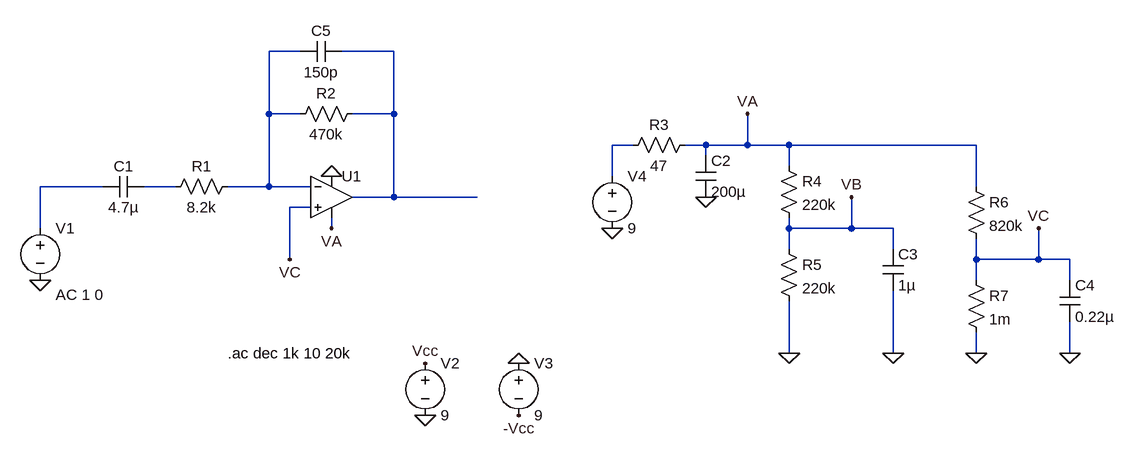
[diagram p0: schematic op_amp3.asc]
op_amp3.asc, the LTspice schematic file:
Version 4
SHEET 1 3044 724
WIRE 448 -256 400 -256
WIRE 592 -256 512 -256
WIRE 400 -160 400 -256
WIRE 448 -160 400 -160
WIRE 592 -160 592 -256
WIRE 592 -160 528 -160
WIRE 960 -112 928 -112
WIRE 1072 -112 1040 -112
WIRE 1136 -112 1136 -160
WIRE 1136 -112 1072 -112
WIRE 1200 -112 1136 -112
WIRE 1488 -112 1200 -112
WIRE 1072 -96 1072 -112
WIRE 1200 -80 1200 -112
WIRE 928 -64 928 -112
WIRE 144 -48 48 -48
WIRE 256 -48 208 -48
WIRE 400 -48 400 -160
WIRE 400 -48 336 -48
WIRE 464 -48 400 -48
WIRE 1488 -48 1488 -112
WIRE 592 -32 592 -160
WIRE 592 -32 528 -32
WIRE 720 -32 592 -32
WIRE 464 -16 432 -16
WIRE 48 16 48 -48
WIRE 496 16 496 0
WIRE 1200 16 1200 0
WIRE 1296 16 1296 -32
WIRE 1296 16 1200 16
WIRE 1360 16 1296 16
WIRE 1200 48 1200 16
WIRE 1360 48 1360 16
WIRE 432 64 432 -16
WIRE 1488 64 1488 32
WIRE 1584 64 1584 16
WIRE 1584 64 1488 64
WIRE 1632 64 1584 64
WIRE 1488 96 1488 64
WIRE 1632 96 1632 64
WIRE 1200 208 1200 128
WIRE 1360 208 1360 112
WIRE 1488 208 1488 176
WIRE 1632 208 1632 160
FLAG 640 304 0
FLAG 784 224 0
FLAG 640 224 Vcc
FLAG 784 304 -Vcc
FLAG 48 96 0
FLAG 928 16 0
FLAG 1072 -32 0
FLAG 1136 -160 VA
FLAG 1296 -32 VB
FLAG 496 16 VA
FLAG 432 64 VC
FLAG 496 -64 0
FLAG 1200 208 0
FLAG 1360 208 0
FLAG 1488 208 0
FLAG 1632 208 0
FLAG 1584 16 VC
SYMBOL voltage 640 208 R0
SYMATTR InstName V2
SYMATTR Value 9
SYMBOL voltage 784 208 R0
SYMATTR InstName V3
SYMATTR Value 9
SYMBOL OpAmps/UniversalOpAmp 496 -32 R0
SYMATTR InstName U1
SYMBOL voltage 48 0 R0
WINDOW 123 24 118 Left 2
SYMATTR Value2 AC 1 0
SYMATTR InstName V1
SYMATTR Value ""
SYMBOL cap 208 -64 R90
WINDOW 0 0 32 VBottom 2
WINDOW 3 32 32 VTop 2
SYMATTR InstName C1
SYMATTR Value 4.7µ
SYMBOL res 352 -64 R90
WINDOW 0 0 56 VBottom 2
WINDOW 3 32 56 VTop 2
SYMATTR InstName R1
SYMATTR Value 8.2k
SYMBOL res 544 -176 R90
WINDOW 0 0 56 VBottom 2
WINDOW 3 32 56 VTop 2
SYMATTR InstName R2
SYMATTR Value 470k
SYMBOL voltage 928 -80 R0
SYMATTR InstName V4
SYMATTR Value 9
SYMBOL res 1056 -128 R90
WINDOW 0 0 56 VBottom 2
WINDOW 3 32 56 VTop 2
SYMATTR InstName R3
SYMATTR Value 47
SYMBOL cap 1056 -96 R0
SYMATTR InstName C2
SYMATTR Value 200µ
SYMBOL res 1184 -96 R0
SYMATTR InstName R4
SYMATTR Value 220k
SYMBOL res 1184 32 R0
SYMATTR InstName R5
SYMATTR Value 220k
SYMBOL cap 1344 48 R0
SYMATTR InstName C3
SYMATTR Value 1µ
SYMBOL res 1472 -64 R0
SYMATTR InstName R6
SYMATTR Value 820k
SYMBOL res 1472 80 R0
SYMATTR InstName R7
SYMATTR Value 1m
SYMBOL cap 1616 96 R0
SYMATTR InstName C4
SYMATTR Value 0.22µ
SYMBOL cap 512 -272 R90
WINDOW 0 0 32 VBottom 2
WINDOW 3 32 32 VTop 2
SYMATTR InstName C5
SYMATTR Value 150p
TEXT 336 208 Left 2 !.ac dec 1k 10 20k

The netlist it stands for:
* op_amp3.asc
V2 Vcc 0 9
V3 0 -Vcc 9
XU1 VC N001 0 VA N002 level1 Avol=1Meg GBW=10Meg Vos=0 En=0 Enk=0 In=0 Ink=0 Rin=500Meg  ; pins In+ In- V+ V- OUT
V1 N004 0 AC 1 0
C1 N005 N004 4.7µ
R1 N001 N005 8.2k
R2 N002 N001 470k
V4 N003 0 9
R3 VA N003 47
C2 VA 0 200µ
R4 VA VB 220k
R5 VB 0 220k
C3 VB 0 1µ
R6 VA VC 820k
R7 VC 0 1m
C4 VC 0 0.22µ
C5 N002 N001 150p
.ac dec 1k 10 20k
.lib UniversalOpAmp1.lib
.backanno
.end